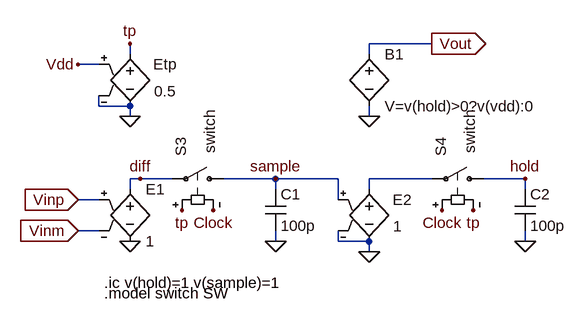
[diagram p0: schematic Ideal_clocked_comparator.asc]
Ideal_clocked_comparator.asc, the LTspice schematic file:
Version 4
SHEET 1 6308 700
WIRE 1104 -288 1008 -288
WIRE 640 -272 640 -288
WIRE 1008 -272 1008 -288
WIRE 592 -256 560 -256
WIRE 592 -192 592 -208
WIRE 640 -192 592 -192
WIRE 640 -176 640 -192
WIRE 1008 -176 1008 -192
WIRE 656 -80 640 -80
WIRE 704 -80 656 -80
WIRE 864 -80 784 -80
WIRE 960 -80 864 -80
WIRE 1104 -80 1008 -80
WIRE 1248 -80 1184 -80
WIRE 640 -64 640 -80
WIRE 864 -64 864 -80
WIRE 1008 -64 1008 -80
WIRE 1248 -64 1248 -80
WIRE 592 -48 560 -48
WIRE 960 -48 960 -80
WIRE 592 0 560 0
WIRE 864 16 864 0
WIRE 960 16 960 0
WIRE 1008 16 960 16
WIRE 1248 16 1248 0
WIRE 1008 32 1008 16
FLAG 1104 -288 Vout
IOPIN 1104 -288 Out
FLAG 560 -48 Vinp
IOPIN 560 -48 In
FLAG 768 -32 Clock
FLAG 560 0 Vinm
IOPIN 560 0 In
FLAG 640 16 0
FLAG 864 16 0
FLAG 1248 16 0
FLAG 560 -256 Vdd
FLAG 640 -176 0
FLAG 640 -288 tp
FLAG 720 -32 tp
FLAG 1168 -32 tp
FLAG 656 -80 diff
FLAG 864 -80 sample
FLAG 1248 -80 hold
FLAG 1120 -32 Clock
FLAG 1008 32 0
FLAG 1008 -176 0
SYMBOL e 640 -80 R0
SYMATTR InstName E1
SYMATTR Value 1
SYMBOL sw 800 -80 M270
WINDOW 3 24 -12 Left 0
WINDOW 38 39 37 Left 0
WINDOW 0 35 82 Left 0
SYMATTR Value ""
SYMATTR SpiceModel switch
SYMATTR InstName S3
SYMBOL sw 1200 -80 M270
WINDOW 3 24 -12 Left 0
WINDOW 38 39 37 Left 0
WINDOW 0 35 82 Left 0
SYMATTR Value ""
SYMATTR SpiceModel switch
SYMATTR InstName S4
SYMBOL cap 848 -64 R0
SYMATTR InstName C1
SYMATTR Value 100p
SYMBOL cap 1232 -64 R0
SYMATTR InstName C2
SYMATTR Value 100p
SYMBOL e 640 -288 R0
WINDOW 0 36 32 Left 0
WINDOW 3 37 73 Left 0
SYMATTR InstName Etp
SYMATTR Value 0.5
SYMBOL e 1008 -80 R0
WINDOW 0 36 32 Left 0
WINDOW 3 37 73 Left 0
SYMATTR InstName E2
SYMATTR Value 1
SYMBOL bv 1008 -288 R0
SYMATTR InstName B1
SYMATTR Value V=v(hold)>0?v(vdd):0
TEXT 600 96 Left 0 !.model switch SW
TEXT 600 80 Left 0 !.ic v(hold)=1 v(sample)=1

The netlist it stands for:
* Ideal_clocked_comparator.asc
E1 diff 0 Vinp Vinm 1
S3 sample diff tp Clock switch
S4 hold N001 Clock tp switch
C1 sample 0 100p
C2 hold 0 100p
Etp tp 0 Vdd 0 0.5
E2 N001 0 sample 0 1
B1 Vout 0 V=v(hold)>0?v(vdd):0
.model switch SW
.ic v(hold)=1 v(sample)=1
.backanno
.end